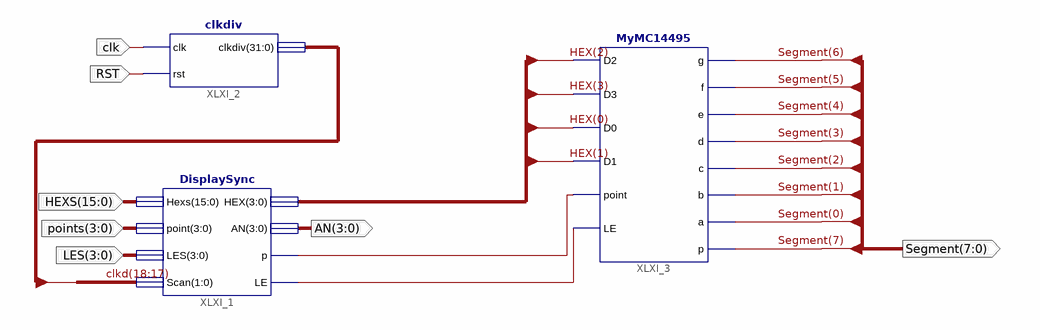
[diagram p0: schematic sheet 1]
// Xilinx ISE schematic DispNum.sch (kintex7) as structural Verilog: 3 symbols, 7 ports
module DispNum (
  input  [15:0] HEXS,
  input  [3:0] LES,
  input  [3:0] points,
  input  clk,
  input  RST,
  output [3:0] AN,
  output [7:0] Segment
);

  wire XLXN_9, XLXN_10;
  wire [3:0] HEX;
  wire [31:0] clkd;

  DisplaySync XLXI_1 (
    .Hexs(HEXS), .point(points), .LES(LES), .Scan(clkd[18:17]), .HEX(HEX), .AN(AN), .p(XLXN_9), .LE(XLXN_10));
  clkdiv XLXI_2 (.clk(clk), .rst(RST), .clkdiv(clkd));
  MyMC14495 XLXI_3 (
    .D2(HEX[2]), .D3(HEX[3]), .D0(HEX[0]), .D1(HEX[1]), .point(XLXN_9), .LE(XLXN_10), .g(Segment[6]),
    .f(Segment[5]), .e(Segment[4]), .d(Segment[3]), .c(Segment[2]), .b(Segment[1]), .a(Segment[0]),
    .p(Segment[7]));
endmodule
